# Altium schematic sheet cb_v2.SchDoc
size A4
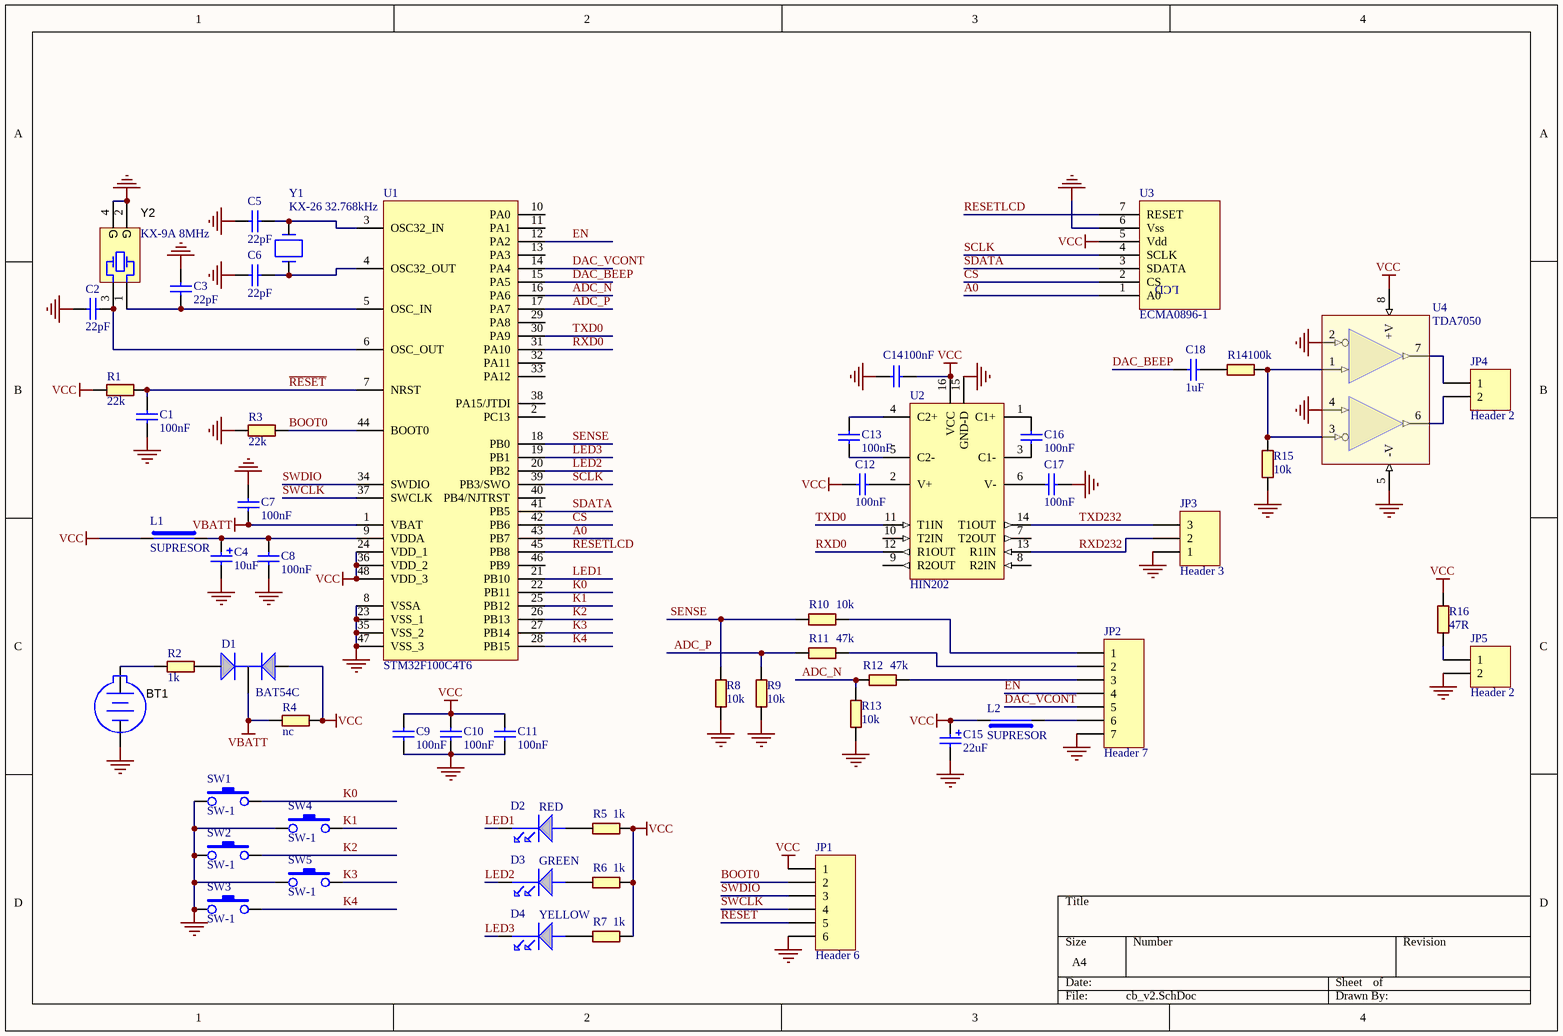
[diagram p0: cb_v2.SchDoc]

## Parts
BT1  BS-7  [BAT_BS-7]  (value not drawn)
C1  100nF  [C-0603]
C2  22pF  [C-0603]
C3  22pF  [C-0603]
C4  10uF  [TANTAL-A]
C5  22pF  [C-0603]
C6  22pF  [C-0603]
C7  100nF  [C-0603]
C8  100nF  [C-0603]
C9  100nF  [C-0603]
C10  100nF  [C-0603]
C11  100nF  [C-0603]
C12  100nF  [C-0603]
C13  100nF  [C-0603]
C14  100nF  [C-0603]
C15  22uF  [TANTAL-A]
C16  100nF  [C-0603]
C17  100nF  [C-0603]
C18  1uF  [C-0603]
D1  BAT54C  [SOT-23]
D2  RED  [LED-DIP-1]
D3  GREEN  [LED-DIP-1]
D4  YELLOW  [LED-DIP-1]
JP1  Header 6  [HDR1X6]
JP2  Header 7  [HDR1X7]
JP3  Header 3  [HDR1X3]
JP4  Header 2  [HDR1X2]
JP5  Header 2  [HDR1X2]
L1  SUPRESOR  [R-1206]
L2  SUPRESOR  [R-1206]
R1  22k  [R-0603]
R2  1k  [R-0603]
R3  22k  [R-0603]
R4  nc  [R-0603]
R5  1k  [R-0603]
R6  1k  [R-0603]
R7  1k  [R-0603]
R8  10k  [R-0603]
R9  10k  [R-0603]
R10  10k  [R-0603]
R11  47k  [R-0603]
R12  47k  [R-0603]
R13  10k  [R-0603]
R14  100k  [R-0603]
R15  10k  [R-0603]
R16  47R  [R-1206]
SW1  SW-1  [SW4-2]
SW2  SW-1  [SW4-2]
SW3  SW-1  [SW4-2]
SW4  SW-1  [SW4-2]
SW5  SW-1  [SW4-2]
U1  STM32F100C4T6  [TSQFP50P900X900X160-48N]
U2  HIN202  [SSOP16NW]
U3  ECMA0896-1  [ECMA0896]
U4  TDA7050  [SO8-(SOT-96-1)]
Y1  KX-26 32.768kHz  [KX-327]
Y2  KX-9A 8MHz  [KX-9A]

## Nets
GND: BT1.2(-) C1.2 C2.1 C3.2 C4.1 C5.1 C6.2 C7.1 C8.2 C9.2 C10.2 C11.2 C14.1 C15.1 C17.2 JP1.6 JP2.7 JP3.1 JP5.2 R3.1 R8.1 R9.1 R13.1 R15.1 SW1.2 SW2.2 SW3.2 SW4.2 SW5.2 U1.8(VSSA) U1.23(VSS_1) U1.35(VSS_2) U1.47(VSS_3) U2.15(GND-D) U3.6(Vss) U4.2(IN1-) U4.4(IN2+) U4.5(-V) Y2.2(GND) Y2.4(GND)  [also labelled GND-D]
VBATT: C7.2 D1.2 R4.1 U1.1(VBAT)
VCC: C9.1 C10.1 C11.1 C12.1 C14.2 C15.2 D1.1 JP1.1 L1.1 L2.2 R1.1 R4.2 R5.2 R6.2 R7.2 R16.2 U1.24(VDD_1) U1.36(VDD_2) U1.48(VDD_3) U2.16(VCC) U3.5(Vdd) U4.8(+V)
A0: U1.43(PB7) U3.1(A0)
ADC_N: R12.2 R13.2 U1.16(PA6)
ADC_P: R9.2 R11.1 U1.17(PA7)
BOOT0: JP1.2 R3.2 U1.44(BOOT0)
CS: U1.42(PB6) U3.2(CS)
DAC_BEEP: C18.1 U1.15(PA5)
DAC_VCONT: JP2.5 U1.14(PA4)
EN: JP2.4 U1.12(PA2)
K0: SW1.1 U1.22(PB11)
K1: SW4.1 U1.25(PB12)
K2: SW2.1 U1.26(PB13)
K3: SW5.1 U1.27(PB14)
K4: SW3.1 U1.28(PB15)
LED1: D2.K(CATHODE) U1.21(PB10)
LED2: D3.K(CATHODE) U1.20(PB2)
LED3: D4.K(CATHODE) U1.19(PB1)
~{RESET}: C1.1 JP1.5 R1.2 U1.7(NRST)
RESETLCD: U1.45(PB8) U3.7(RESET)
RXD0: U1.31(PA10) U2.12(R1OUT)
RXD232: JP3.2 U2.13(R1IN)
SCLK: U1.39(PB3/SWO) U3.4(SCLK)
SDATA: U1.41(PB5) U3.3(SDATA)
SENSE: R8.2 R10.1 U1.18(PB0)
SWCLK: JP1.4 U1.37(SWCLK)
SWDIO: JP1.3 U1.34(SWDIO)
TXD0: U1.30(PA9) U2.11(T1IN)
TXD232: JP3.3 U2.14(T1OUT)
NetBT1_1: BT1.1(+) R2.1
NetC2_2: C2.2 U1.6(OSC_OUT) Y2.3
NetC3_1: C3.1 U1.5(OSC_IN) Y2.1
NetC4_2: C4.2 C8.1 L1.2 U1.9(VDDA)
NetC5_2: C5.2 U1.3(OSC32_IN) Y1.1
NetC6_1: C6.1 U1.4(OSC32_OUT) Y1.2
NetC12_2: C12.2 U2.2(V+)
NetC13_1: C13.1 U2.4(C2+)
NetC13_2: C13.2 U2.5(C2-)
NetC16_1: C16.1 U2.1(C1+)
NetC16_2: C16.2 U2.3(C1-)
NetC17_1: C17.1 U2.6(V-)
NetC18_2: C18.2 R14.1
NetD1_3: D1.3 R2.2
NetD2_A: D2.A(ANODE) R5.1
NetD3_A: D3.A(ANODE) R6.1
NetD4_A: D4.A(ANODE) R7.1
NetJP2_1: JP2.1 R10.2
NetJP2_2: JP2.2 R11.2
NetJP2_3: JP2.3 R12.1
NetJP2_6: JP2.6 L2.1
NetJP4_1: JP4.1 U4.7(OUT1)
NetJP4_2: JP4.2 U4.6(OUT2)
NetJP5_1: JP5.1 R16.1
NetR14_2: R14.2 R15.2 U4.1(IN1+) U4.3(IN2-)

Not connected (* = marked no-connect by the designer): U1 2(PC13) 10(PA0) 11(PA1) 13(PA3) 29(PA8) 32(PA11) 33(PA12) 38(PA15/JTDI) 40(PB4/NJTRST) 46(PB9); U2 7(T2OUT) 8(R2IN) 9(R2OUT) 10(T2IN)

## Notes on the sheet
- (in symbol ECMA0896) LCD
- (in symbol TSX-3225 24.0000MF20G-AC3) G

## Library data of the parts
BT1 = BS-7: Battery Holder, CR2032, Retainer clip, TH; Manufacturer: Memory Protection Devices; SymbolCreator: a0412235; SymbolVersion: 2013-01-08; CompType: Battery Holder; PartNumber: BS-7; RoHS: Y; PackageReference: CR2032 holder; MountType: TH; ComponentLink1Description: Datasheet Link; ComponentLink1URL: http://www.memoryprotectiondevices.com/datasheets/BS-7-datasheet.pdf; Publisher: Texas Instruments; LatestRevisionDate: 2014-08-06; Supplier 1: Digi-Key; Supplier Part Number 1: BS-7-ND
C1-C3 C5-C14 C16-C18 = CAPN: Part Field 1: Hitano; Part Field 7: 10%; Part Field 8: 50V; Part Field 9: X7R
C4 C15 = CAPP: Part Field 1: *; Part Field 7: *; Part Field 8: *; Part Field 9: *
D1 = BAV70
D2-D4 = LED
JP1 = Header 6: Header, 6-Pin; LatestRevisionDate: 17-Jul-2002; LatestRevisionNote: Re-released for DXP Platform.; Publisher: Altium Limited
JP2 = Header 7: Header, 7-Pin; LatestRevisionDate: 17-Jul-2002; LatestRevisionNote: Re-released for DXP Platform.; Publisher: Altium Limited
JP3 = Header 3: Header, 3-Pin; LatestRevisionDate: 17-Jul-2002; LatestRevisionNote: Re-released for DXP Platform.; Publisher: Altium Limited
JP4 JP5 = Header 2: Header, 2-Pin; LatestRevisionDate: 17-Jul-2002; LatestRevisionNote: Re-released for DXP Platform.; Publisher: Altium Limited
R1-R15 = RES: Part Field 1: UniOhm; Part Field 7: 5%
R16 = RES
U1 = STM32F100CxT6
U2 = HIN202: RS232 driver; Производитель: *; Допустимая замена: *; Цена: *; PDF файл: *; Температурный диапазон: *
U3 = ECMA0896
Y1 = Y: Производитель: *; CrossRef: *; Цена: *; PDF: *; T-range: *
Y2 = TSX-3225 24.0000MF20G-AC3: Crystal, 24 MHz, 9 pF, SMD; Manufacturer: Epson; SymbolCreator: a0412235; U/M: EA; TaMin_C: -40; TaMax_C: 85; Frequency Stability: ±20ppm; SymbolVersion: 2011-08-23; PartNumber: TSX-3225 24.0000MF20G-AC3; Frequency: 8 MHz; CompType: Crystal; PackageReference: SMD, 4-Leads, Body 2.65x3.35mm, Height 0.6mm; MountType: SMT; RoHS: Y; ComponentLink1Description: Datasheet Link; ComponentLink1URL: http://www.eea.epson.com/portal/pls/portal/docs/1/1729491.PDF; Publisher: Texas Instruments; LatestRevisionDate: 2014-08-15; Supplier 1: Digi-Key; Supplier Part Number 1: SER3634CT-ND; Supplier 2: Mouser; Supplier Part Number 2: 732-TX325-24F20G-AC3
L1 L2 = SUPRESOR: Примечание: *; Производитель: *
SW1-SW5 = SW-1: Производитель: *; Допустимая замена: *; Цена: *; PDF файл: *; Температурный диапазон: *; Описание пользователя: *; *: *